# Altium schematic sheet 2.SIM Interface.SchDoc
size A4
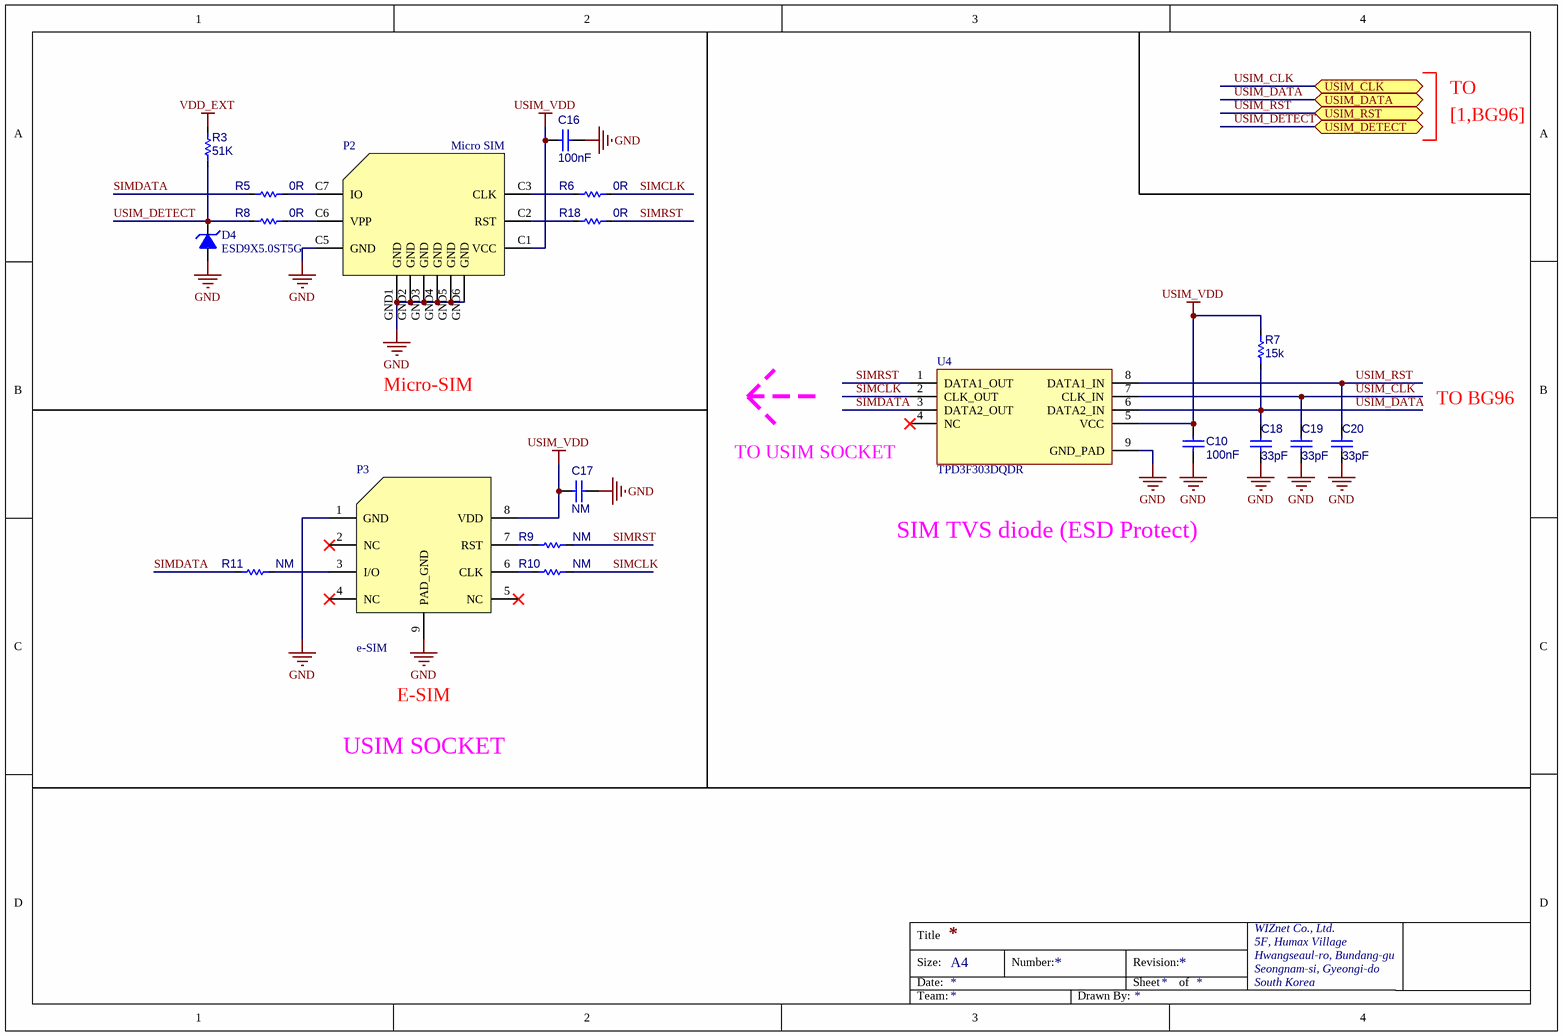
[diagram p0: 2.SIM Interface.SchDoc]

## Parts
C10  100nF  [CAP-0402]
C16  100nF  [CAP-0402]
C17  NM  [CAP-0402]
C18  33pF  [CAP-0402]
C19  33pF  [CAP-0402]
C20  33pF  [CAP-0402]
D4  ESD9X5.0ST5G  [SOD-923(1-C,2-A)]
P2  Micro SIM  [MOLEX-SD-78646-001]
P3  e-SIM  [MFF2(1.27/5x6)]
R3  51K  [RES-0402]
R5  0R  [RES-0402]
R6  0R  [RES-0402]
R7  15k  [RES-0402]
R8  0R  [RES-0402]
R9  NM  [RES-0402]
R10  NM  [RES-0402]
R11  NM  [RES-0402]
R18  0R  [RES-0402]
U4  TPD3F303DQDR  [PWSON08(0.4/1.45X1.8)]

## Ports
USIM_CLK, USIM_DATA, USIM_DETECT, USIM_RST

## Nets
GND: C10.2 C16.1 C17.1 C18.1 C19.1 C20.1 D4.2 P2.C5(GND) P2.GND1(GND) P2.GND2(GND) P2.GND3(GND) P2.GND4(GND) P2.GND5(GND) P2.GND6(GND) P3.1(GND) P3.9(PAD_GND) U4.9(GND_PAD)
USIM_VDD: C10.1 C16.2 C17.2 P2.C1(VCC) P3.8(VDD) R7.1 U4.5(VCC)
VDD_EXT: R3.1
SIMCLK: R6.1 R10.1 U4.2(CLK_OUT)
SIMDATA: R5.2 R11.2 U4.3(DATA2_OUT)
SIMRST: R9.1 R18.1 U4.1(DATA1_OUT)
USIM_CLK: C19.2 U4.7(CLK_IN) ; port USIM_CLK
USIM_DATA: C18.2 R7.2 U4.6(DATA2_IN) ; port USIM_DATA
USIM_DETECT: D4.1 R3.2 R8.2 ; port USIM_DETECT
USIM_RST: C20.2 U4.8(DATA1_IN) ; port USIM_RST
NetP2_C2: P2.C2(RST) R18.2
NetP2_C3: P2.C3(CLK) R6.2
NetP2_C6: P2.C6(VPP) R8.1
NetP2_C7: P2.C7(IO) R5.1
NetP3_3: P3.3(I/O) R11.1
NetP3_6: P3.6(CLK) R10.2
NetP3_7: P3.7(RST) R9.2

Not connected (* = marked no-connect by the designer): P3 2(NC)* 4(NC)* 5(NC)*; U4 4(NC)*

## Notes on the sheet
- TO
- [1,BG96]
- Micro-SIM
- TO BG96
- TO USIM SOCKET
- SIM TVS diode (ESD Protect)
- E-SIM
- USIM SOCKET
- Title
- Size:
- Date:
- A4
- Number:
- Revision:
- Sheet
- of
- WIZnet Co., Ltd.
- 5F, Humax Village
- Hwangseaul-ro, Bundang-gu
- Seongnam-si, Gyeongi-do
- South Korea
- Team:
- Drawn By:

## Library data of the parts
C10 C16-C20 = CAP-0402: Ceramic CAP 0402(1005)
D4 = ESD9X5.0ST5G: Uni-directional TVS diode
P2 = Micro SIM: Micro SIM SMT 1.45mm Push/Pull
R3 R5-R11 R18 = RES-0402
U4 = TPD3F303DQDR: ESD Protection SIM